# Altium schematic sheet 平衡车.SchDoc
size A2
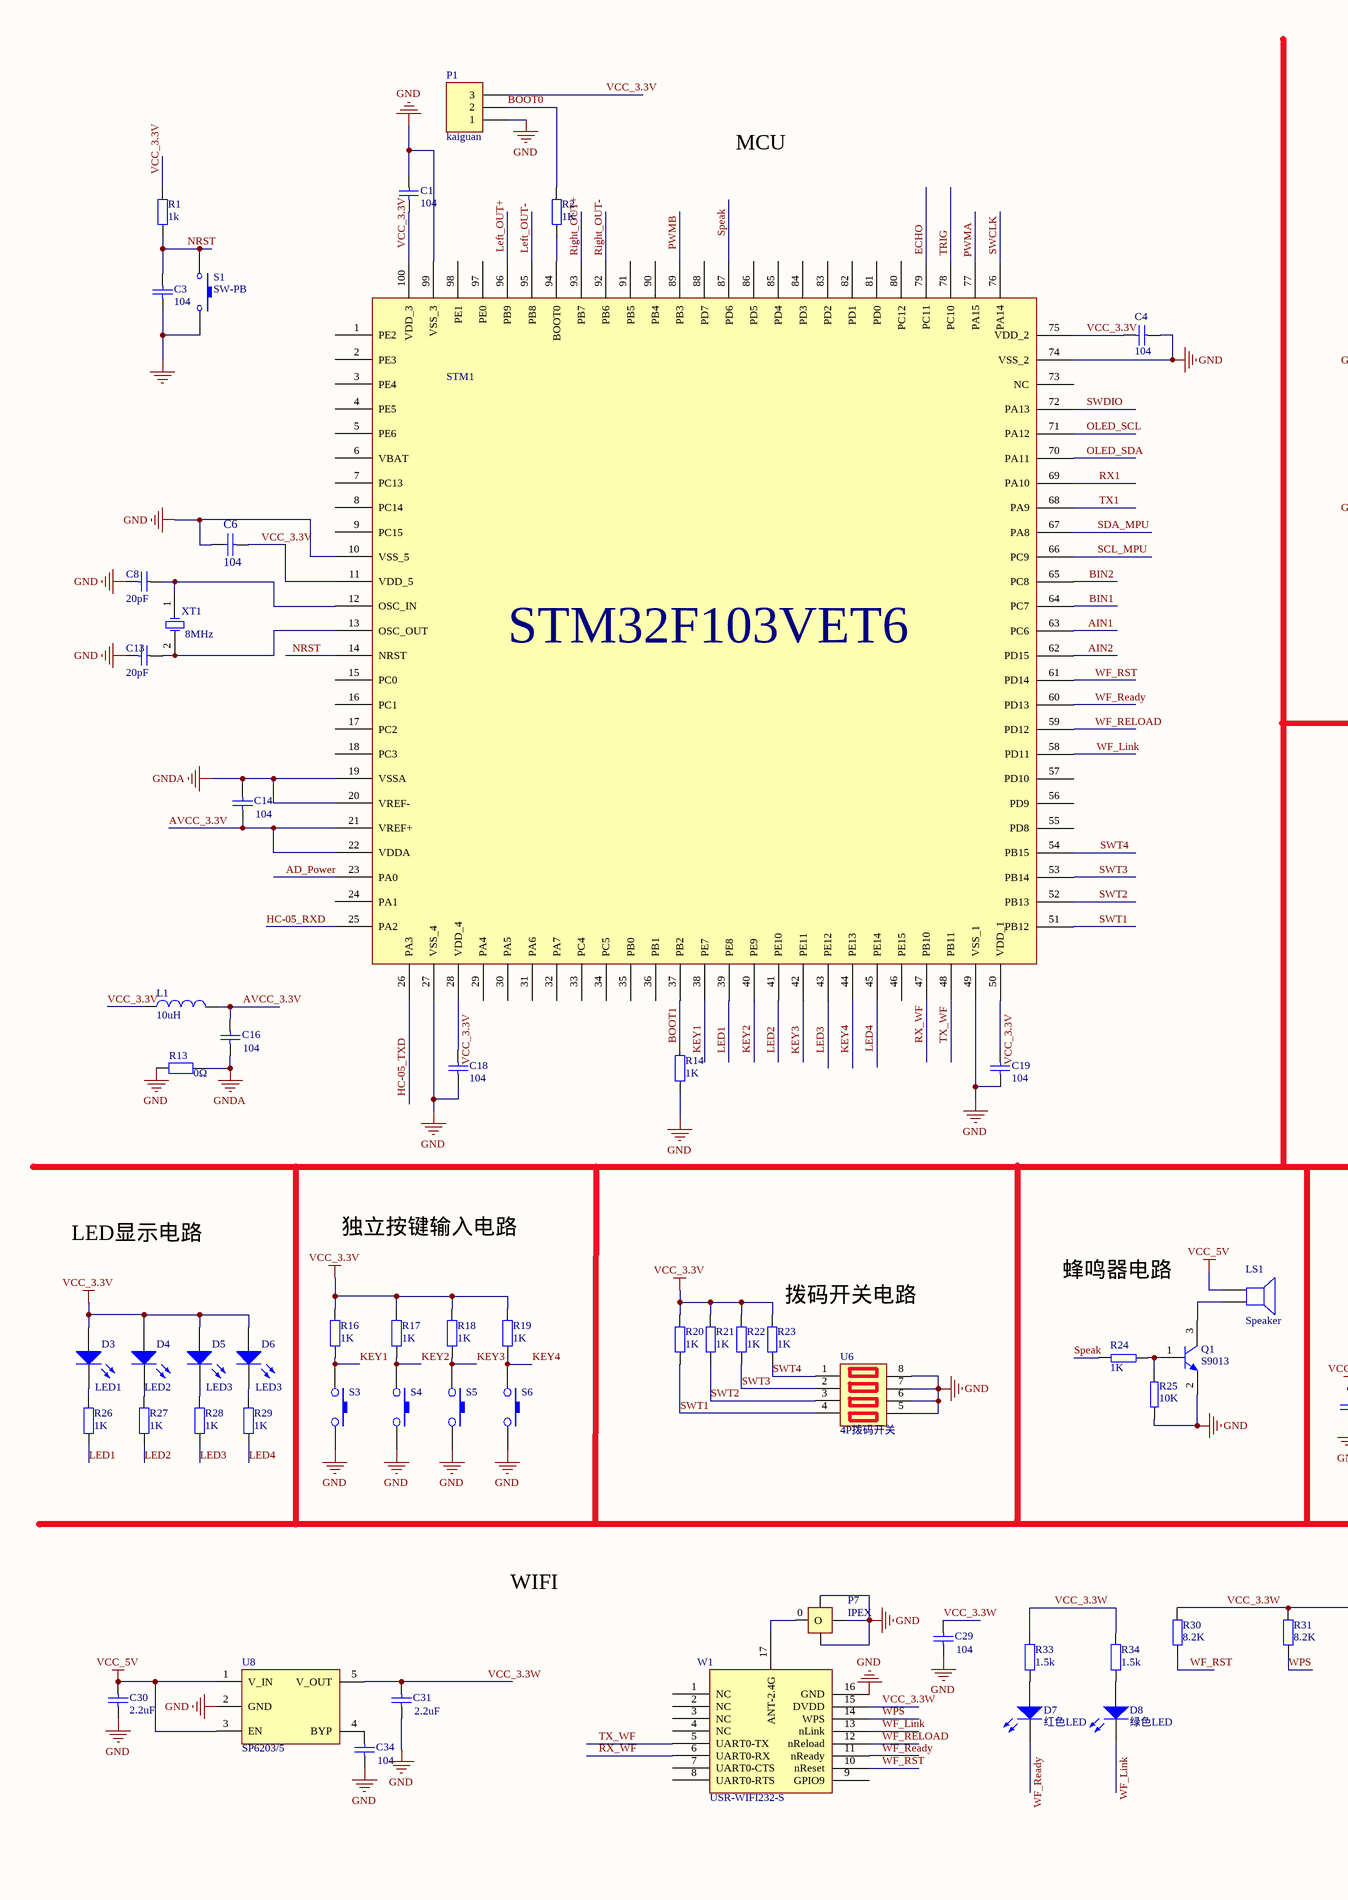
[diagram p0: 平衡车.SchDoc, left]
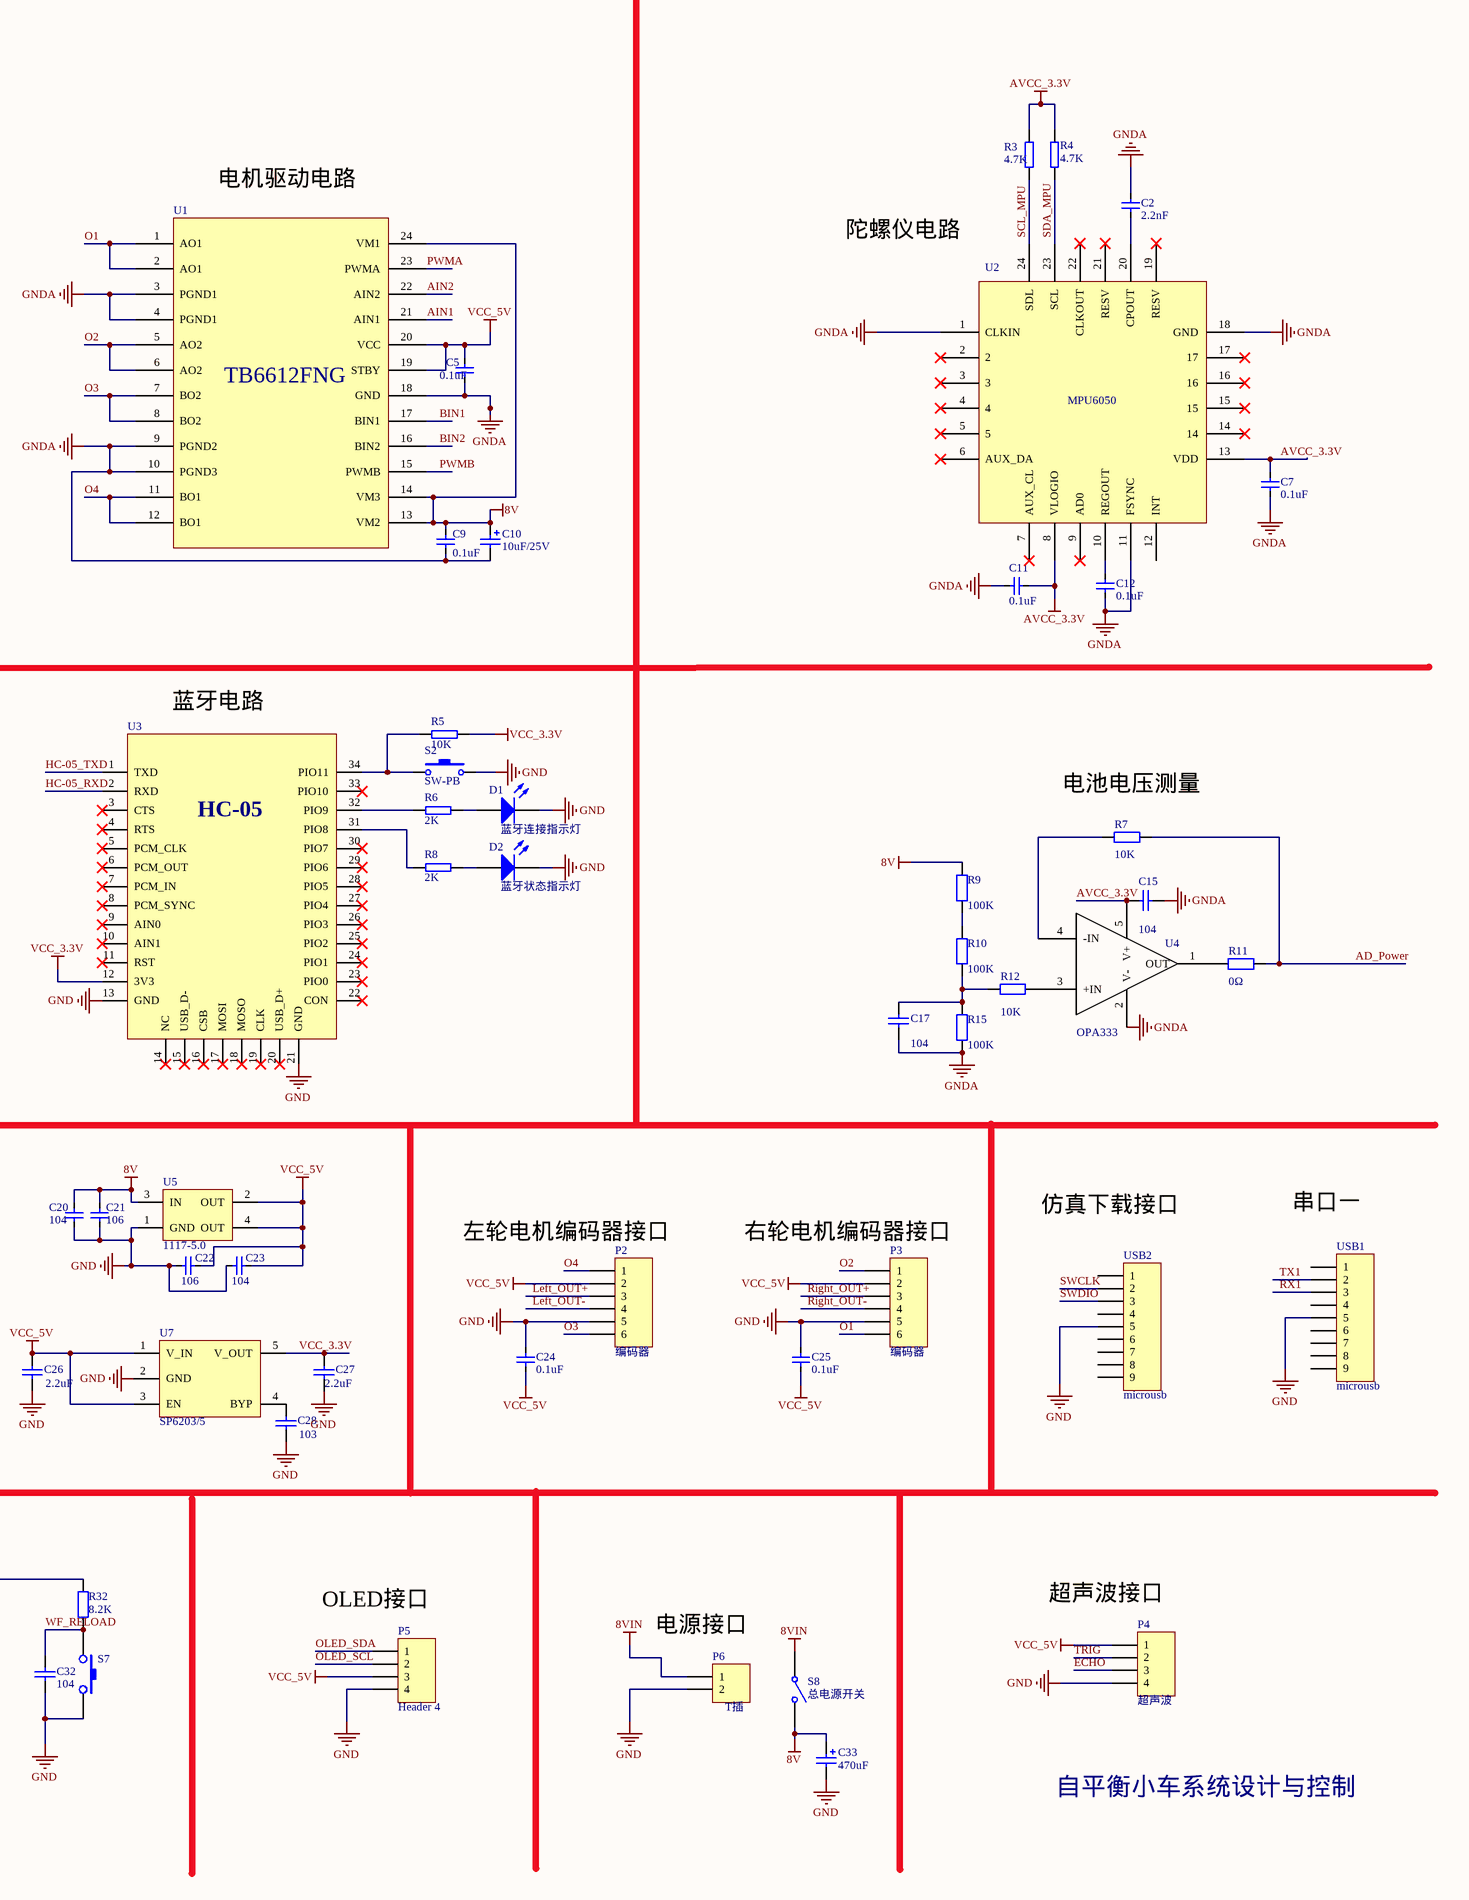
[diagram p1: 平衡车.SchDoc, right]

## Parts
C1  104  [0603电容]
C2  CAP_2.2nf  [0603电容]  (value not drawn)
C3  104  [0603电容]
C4  104  [0603电容]
C5  CAP_104  [0603电容]  (value not drawn)
C6  104  [0603电容]
C7  CAP_104  [0603电容]  (value not drawn)
C8  20pF  [0603电容]
C9  CAP_104  [0603电容]  (value not drawn)
C10  value 10uF/25V  [C型钽电容]  (hidden comment: Cap Pol2)
C11  CAP_104  [0603电容]  (value not drawn)
C12  CAP_104  [0603电容]  (value not drawn)
C13  20pF  [0603电容]
C14  104  [0603电容]
C15  104  [0603电容]
C16  104  [0603电容]
C17  104  [0603电容]
C18  104  [0603电容]
C19  104  [0603电容]
C20  CAP_104  [0603电容]  (value not drawn)
C21  CAP_104  [0603电容]  (value not drawn)
C22  CAP_104  [0603电容]  (value not drawn)
C23  CAP_104  [0603电容]  (value not drawn)
C24  CAP_104  [0603电容]  (value not drawn)
C25  CAP_104  [0603电容]  (value not drawn)
C26  2.2uF  [0603电容]
C27  2.2uF  [0603电容]
C28  103  [0603电容]
C29  104  [0603电容]
C30  2.2uF  [0603电容]
C31  2.2uF  [0603电容]
C32  104  [0603电容]
C33  value 470uF  [470uF]  (hidden comment: Cap Pol2)
C34  104  [0603电容]
D1  蓝牙连接指示灯  [0603LED红色]
D2  蓝牙状态指示灯  [0603LED绿色]
D3  LED1  [0603LED红色]
D4  LED2  [0603LED红色]
D5  LED3  [0603LED红色]
D6  LED3  [0603LED红色]
D7  红色LED  [0603LED红色]
D8  绿色LED  [0603LED绿色]
L1  10uH  [电感]
LS1  Speaker  [孔距5mm蜂鸣器]
P1  kaiguan  [HDR1X3]
P2  编码器  [6P带锁插针底座]
P3  编码器  [6P带锁插针底座]
P4  超声波  [四脚底座]
P5  Header 4  [四脚底座_液晶]
P6  T插  [电源底座]
P7  IPEX  [天线底座]
Q1  S9013  [S8050贴片三极管]
R1  1k  [0603电阻]
R2  1K  [0603电阻]
R3  RES_10K  [0603电阻]  (value not drawn)
R4  RES_10K  [0603电阻]  (value not drawn)
R5  RES_10K  [0603电阻]  (value not drawn)
R6  RES_10K  [0603电阻]  (value not drawn)
R7  10K  [0603电阻]
R8  RES_10K  [0603电阻]  (value not drawn)
R9  100K  [0603电阻]
R10  100K  [0603电阻]
R11  0Ω  [0603电阻]
R12  10K  [0603电阻]
R13  0Ω  [0603电阻]
R14  1K  [0603电阻]
R15  100K  [0603电阻]
R16  1K  [0603电阻]
R17  1K  [0603电阻]
R18  1K  [0603电阻]
R19  1K  [0603电阻]
R20  1K  [0603电阻]
R21  1K  [0603电阻]
R22  1K  [0603电阻]
R23  1K  [0603电阻]
R24  RES_10K  [0603电阻]  (value not drawn)
R25  RES_10K  [0603电阻]  (value not drawn)
R26  1K  [0603电阻]
R27  1K  [0603电阻]
R28  1K  [0603电阻]
R29  1K  [0603电阻]
R30  8.2K  [0603电阻]
R31  8.2K  [0603电阻]
R32  8.2K  [0603电阻]
R33  1.5k  [0603电阻]
R34  1.5k  [0603电阻]
S1  SW-PB  [贴片按键]
S2  SW-PB  [贴片按键]
S3  SW-PB  [贴片按键]  (value not drawn)
S4  SW-PB  [贴片按键]  (value not drawn)
S5  SW-PB  [贴片按键]  (value not drawn)
S6  SW-PB  [贴片按键]  (value not drawn)
S7  SW-PB  [贴片按键]  (value not drawn)
S8  总电源开关  [纽子开关]
STM1  STM32F103VET6  [LQFP 100]  (value not drawn)
U1  TB6612FNG  [TB6612]
U2  MPU6050  [MPU6050_3mm]
U3  HC-05蓝牙  [HC-05蓝牙邮票孔]  (value not drawn)
U4  OPA333  [LM2735]
U5  1117-5.0  [1117稳压]
U6  4P拨码开关  [4P贴片拨码开关]
U7  SP6203/5  [LM2735]
U8  SP6203/5  [LM2735]
USB1  microusb  [Microusb]
USB2  microusb  [Microusb]
W1  USR-WIFI232-S  [WIFI]
XT1  8MHz  [两脚贴片晶振]

## Nets
8V: C9.2 C10.1 C20.2 C21.2 C33.1 R9.2 S8.2(NO) U1.13(VM2) U1.14(VM3) U1.24(VM1) U5.3(IN)
8VIN: P6.1 S8.1(COMMON)
AVCC_3.3V: C7.2 C11.2 C14.1 C15.2 C16.2 L1.2 R3.2 R4.2 STM1.21(VREF+) STM1.22(VDDA) U2.8(VLOGIO) U2.13(VDD) U4.5(V+)
GND: C1.2 C3.1 C4.1 C6.2 C8.1 C13.1 C18.1 C19.1 C20.1 C21.1 C22.2 C23.1 C24.1 C25.1 C26.1 C27.1 C28.1 C29.1 C30.1 C31.1 C32.1 C33.2 C34.1 D1.2(K) D2.2(K) P1.1 P2.5 P3.5 P4.4 P5.4 P6.2 P7.1 P7.2 P7.3 Q1.2(E) R13.1 R14.2 R25.2 S1.2 S2.2 S3.2 S4.2 S5.2 S6.2 S7.2 STM1.10(VSS_5) STM1.27(VSS_4) STM1.49(VSS_1) STM1.74(VSS_2) STM1.99(VSS_3) U3.13(GND) U3.21(GND) U5.1(GND) U6.5 U6.6 U6.7 U6.8 U7.2(GND) U8.2(GND) USB1.5 USB2.5 W1.16(GND)
GNDA: C2.1 C5.2 C7.1 C9.1 C10.2 C11.1 C12.1 C14.2 C15.1 C16.1 C17.2 R13.2 R15.1 STM1.19(VSSA) STM1.20(VREF-) U1.3(PGND1) U1.4(PGND1) U1.9(PGND2) U1.10(PGND3) U1.18(GND) U2.1(CLKIN) U2.11(FSYNC) U2.18(GND) U4.2(V-)
VCC_3.3V: C1.1 C4.2 C6.1 C18.2 C19.2 C27.2 D3.1(A) D4.1(A) D5.1(A) D6.1(A) L1.1 P1.3 R1.1 R5.1 R16.2 R17.2 R18.2 R19.1 R20.2 R21.2 R22.2 R23.1 STM1.11(VDD_5) STM1.28(VDD_4) STM1.50(VDD_1) STM1.75(VDD_2) STM1.100(VDD_3) U3.12(3V3) U7.5(V_OUT)
VCC_5V: C5.1 C22.1 C23.2 C24.2 C25.2 C26.2 C30.2 LS1.1 P2.2 P3.2 P4.1 P5.3 U1.19(STBY) U1.20(VCC) U5.2(OUT) U5.4(OUT) U7.1(V_IN) U7.3(EN) U8.1(V_IN) U8.3(EN)
AD_Power: R7.2 R11.2 STM1.23(PA0)
AIN1: STM1.63(PC6) U1.21(AIN1)
AIN2: STM1.62(PD15) U1.22(AIN2)
BIN1: STM1.64(PC7) U1.17(BIN1)
BIN2: STM1.65(PC8) U1.16(BIN2)
BOOT0: P1.2 R2.1
BOOT1: R14.1 STM1.37(PB2)
ECHO: P4.3 STM1.79(PC11)
HC-05_RXD: STM1.25(PA2) U3.2(RXD)
HC-05_TXD: STM1.26(PA3) U3.1(TXD)
KEY1: R16.1 S3.1 STM1.38(PE7)
KEY2: R17.1 S4.1 STM1.40(PE9)
KEY3: R18.1 S5.1 STM1.42(PE11)
KEY4: R19.2 S6.1 STM1.44(PE13)
LED1: R26.1 STM1.39(PE8)
LED2: R27.1 STM1.41(PE10)
LED3: R28.1 STM1.43(PE12)
LED4: R29.1 STM1.45(PE14)
Left_OUT+: P2.3 STM1.96(PB9)
Left_OUT-: P2.4 STM1.95(PB8)
NRST: C3.2 R1.2 S1.1 STM1.14(NRST)
O1: P3.6 U1.1(AO1) U1.2(AO1)
O2: P3.1 U1.5(AO2) U1.6(AO2)
O3: P2.6 U1.7(BO2) U1.8(BO2)
O4: P2.1 U1.11(BO1) U1.12(BO1)
OLED_SCL: P5.2 STM1.71(PA12)
OLED_SDA: P5.1 STM1.70(PA11)
PWMA: STM1.77(PA15) U1.23(PWMA)
PWMB: STM1.89(PB3) U1.15(PWMB)
Right_OUT+: P3.3 STM1.93(PB7)
Right_OUT-: P3.4 STM1.92(PB6)
RX1: STM1.69(PA10) USB1.3
RX_WF: STM1.47(PB10) W1.6(UART0-RX)
SCL_MPU: R3.1 STM1.66(PC9) U2.24(SDL)
SDA_MPU: R4.1 STM1.67(PA8) U2.23(SCL)
Speak: R24.1 STM1.87(PD6)
SWCLK: STM1.76(PA14) USB2.2
SWDIO: STM1.72(PA13) USB2.3
SWT1: R20.1 STM1.51(PB12) U6.4
SWT2: R21.1 STM1.52(PB13) U6.3
SWT3: R22.1 STM1.53(PB14) U6.2
SWT4: R23.2 STM1.54(PB15) U6.1
TRIG: P4.2 STM1.78(PC10)
TX1: STM1.68(PA9) USB1.2
TX_WF: STM1.48(PB11) W1.5(UART0-TX)
VCC_3.3W: C29.2 C31.2 R30.1 R31.1 R32.1 R33.2 R34.2 U8.5(V_OUT) W1.15(DVDD)
WF_Link: D8.2(K) STM1.58(PD11) W1.13(nLink)
WF_Ready: D7.2(K) STM1.60(PD13) W1.11(nReady)
WF_RELOAD: C32.2 R32.2 S7.1 STM1.59(PD12) W1.12(nReload)
WF_RST: R30.2 STM1.61(PD14) W1.10(nReset)
WPS: R31.2 W1.14(WPS)
NetC2_2: C2.2 U2.20(CPOUT)
NetC8_2: C8.2 STM1.12(OSC_IN) XT1.1(OSC1)
NetC12_2: C12.2 U2.10(REGOUT)
NetC13_2: C13.2 STM1.13(OSC_OUT) XT1.2(OSC2)
NetC17_1: C17.1 R10.1 R12.1 R15.2
NetC28_2: C28.2 U7.4(BYP)
NetC34_2: C34.2 U8.4(BYP)
NetD1_1: D1.1(A) R6.1
NetD2_1: D2.1(A) R8.1
NetD3_2: D3.2(K) R26.2
NetD4_2: D4.2(K) R27.2
NetD5_2: D5.2(K) R28.2
NetD6_2: D6.2(K) R29.2
NetD7_1: D7.1(A) R33.1
NetD8_1: D8.1(A) R34.1
NetLS1_2: LS1.2 Q1.3(C)
NetP7_0: P7.0(O) W1.17(ANT-2.4G)
NetQ1_1: Q1.1(B) R24.2 R25.1
NetR2_2: R2.2 STM1.94(BOOT0)
NetR5_2: R5.2 S2.1 U3.34(PIO11)
NetR6_2: R6.2 U3.32(PIO9)
NetR7_1: R7.1 U4.4(-IN)
NetR8_2: R8.2 U3.31(PIO8)
NetR9_1: R9.1 R10.2
NetR11_1: R11.1 U4.1(OUT)
NetR12_2: R12.2 U4.3(+IN)

Not connected (* = marked no-connect by the designer): STM1 1(PE2) 2(PE3) 3(PE4) 4(PE5) 5(PE6) 6(VBAT) 7(PC13) 8(PC14) 9(PC15) 15(PC0) 16(PC1) 17(PC2) 18(PC3) 24(PA1) 29(PA4) 30(PA5) 31(PA6) 32(PA7) 33(PC4) 34(PC5) 35(PB0) 36(PB1) 46(PE15) 55(PD8) 56(PD9) 57(PD10) 73(NC) 80(PC12) 81(PD0) 82(PD1) 83(PD2) 84(PD3) 85(PD4) 86(PD5) 88(PD7) 90(PB4) 91(PB5) 97(PE0) 98(PE1); U2 2* 3* 4* 5* 6(AUX_DA)* 7(AUX_CL)* 9(AD0)* 12(INT) 14* 15* 16* 17* 19(RESV)* 21(RESV)* 22(CLKOUT)*; U3 3(CTS)* 4(RTS)* 5(PCM_CLK)* 6(PCM_OUT)* 7(PCM_IN)* 8(PCM_SYNC)* 9(AIN0)* 10(AIN1)* 11(RST)* 14(NC)* 15(USB_D-)* 16(CSB)* 17(MOSI)* 18(MOSO)* 19(CLK)* 20(USB_D+)* 22(CON)* 23(PIO0)* 24(PIO1)* 25(PIO2)* 26(PIO3)* 27(PIO4)* 28(PIO5)* 29(PIO6)* 30(PIO7)* 33(PIO10)*; USB1 1 4 6 7 8 9; USB2 1 4 6 7 8 9; W1 1(NC) 2(NC) 3(NC) 4(NC) 7(UART0-CTS) 8(UART0-RTS) 9(GPIO9)

## Notes on the sheet
- MCU
- 电机驱动电路
- 陀螺仪电路
- 蓝牙电路
- (near R7) 电池电压测量
- LED显示电路
- 独立按键输入电路
- 仿真下载接口
- 串口一
- (near R23) 拨码开关电路
- 蜂鸣器电路
- 左轮电机编码器接口
- (near P3) 右轮电机编码器接口
- WIFI
- (near P5) OLED接口
- (near P4) 超声波接口
- (near P6) 电源接口
- 自平衡小车系统设计与控制
- (in symbol CAP_22) 104; 106; 0.1uF; 2.2nF
- (in symbol HC-05蓝牙) HC-05
- (in symbol RES_10K) 4.7K; 1K; 10K; 2K

## Library data of the parts
C1 C3 C4 C8 C13-C19 C26-C32 C34 = Cap: Capacitor; Published: 8-Jun-2000; LatestRevisionDate: 17-Jul-2002; LatestRevisionNote: Re-released for DXP Platform.; PackageReference: RAD-0.3; Publisher: Altium Limited
  C1 C3 C4 C14 C16 C18 C19 C29 C32 C34: PackageDescription: Radial Cap, Thru-Hole; 2 Leads; 0.3 in Pin Spacing; Value: 104
  C8 C13: PackageDescription: Radial Cap, Thru-Hole; 2 Leads; 0.3 in Pin Spacing; Value: 20pF
  C15 C17: Value: 104
  C26 C27 C30 C31: PackageDescription: Radial Cap, Thru-Hole; 2 Leads; 0.3 in Pin Spacing; Value: 2.2uF
  C28: PackageDescription: Radial Cap, Thru-Hole; 2 Leads; 0.3 in Pin Spacing; Value: 103
C2 C5 C7 C9 C11 C12 C20-C25 = CAP_22
C6 = ProA111.TMP_30p_6
C10 C33 = Cap Pol2: Polarized Capacitor (Axial); Published: 8-Jun-2000; LatestRevisionDate: 17-Jul-2002; LatestRevisionNote: Re-released for DXP Platform.; PackageReference: POLAR0.8; Publisher: Altium Limited; PackageDescription: Polarized Capacitor; 2 Leads
D1-D8 = LED0: Typical INFRARED GaAs LED; Published: 8-Jun-2000; LatestRevisionDate: 08-Jul-2005; LatestRevisionNote: Mech Layer 1 removed.; PackageReference: LED-0; Publisher: Altium Limited; PackageDescription: LED; 2 Leads
L1 = Inductor: Code_IEC: 1005; Published: 8-Jun-2000; LatestRevisionDate: 29-May-2009; LatestRevisionNote: IPC-7351 Footprint Added.; PackageReference: 0402-A; Publisher: Altium Limited; Code_JEITA: 0402; Value: 10uH; PackageDescription: Chip Inductor
LS1 = Speaker: Loudspeaker; Published: 24-Mar-1999; LatestRevisionDate: 17-Jul-2002; LatestRevisionNote: Re-released for DXP Platform.; PackageReference: PIN2; Publisher: Altium Limited
P1 = Header 3: Header, 3-Pin; LatestRevisionDate: 17-Jul-2002; LatestRevisionNote: Re-released for DXP Platform.; Publisher: Altium Limited
P2 P3 = Header 6: Header, 6-Pin; LatestRevisionDate: 17-Jul-2002; LatestRevisionNote: Re-released for DXP Platform.; Publisher: Altium Limited
P4 P5 = Header 4: Header, 4-Pin; LatestRevisionDate: 17-Jul-2002; LatestRevisionNote: Re-released for DXP Platform.; Publisher: Altium Limited
P6 = Header 2: Header, 2-Pin; pin to pad: 1>0 2>1; LatestRevisionDate: 17-Jul-2002; LatestRevisionNote: Re-released for DXP Platform.; Publisher: Altium Limited
Q1 = S9013_s
R1 R2 R7 R9-R23 R26-R34 = Res2: Resistor; Published: 8-Jun-2000; LatestRevisionDate: 17-Jul-2002; LatestRevisionNote: Re-released for DXP Platform.; PackageReference: AXIAL-0.4; Publisher: Altium Limited; PackageDescription: Axial Device, Thru-Hole; 2 Leads; 0.4 in Pin Spacing
  R1: Value: 1k
  R2 R14 R16-R23 R26-R29: Value: 1K
  R7 R12: Value: 10K
  R9 R10 R15: Value: 100K
  R11 R13: Value: 0Ω
  R30-R32: Value: 8.2K
  R33 R34: Value: 1.5k
S1 S2 = SW-PB: Switch; Published: 24-Mar-1999; LatestRevisionDate: 17-Jul-2002; LatestRevisionNote: Re-released for DXP Platform.; PackageReference: SPST-2; Publisher: Altium Limited; PackageDescription: Switch; 2 Leads
S8 = SW-SPST: Single-Pole, Single-Throw Switch; Published: 24-Mar-1999; LatestRevisionDate: 17-Jul-2002; LatestRevisionNote: Re-released for DXP Platform.; PackageReference: SPST-2; Publisher: Altium Limited; PackageDescription: Switch; 2 Leads
U5 = 1117
USB1 USB2 = Header 9: Header, 9-Pin; LatestRevisionDate: 17-Jul-2002; LatestRevisionNote: Re-released for DXP Platform.; Publisher: Altium Limited
XT1 = XTAL: Crystal Oscillator; Published: 8-Jun-2000; LatestRevisionDate: 17-Jul-2002; LatestRevisionNote: Re-released for DXP Platform.; PackageReference: R38; Publisher: Altium Limited; PackageDescription: Crystal, Thru-Hole; 2 Leads; Body 3.1 x 8.2 mm (Dia.xH)